# EAGLE schematic breakout (EAGLE 9.0.0)
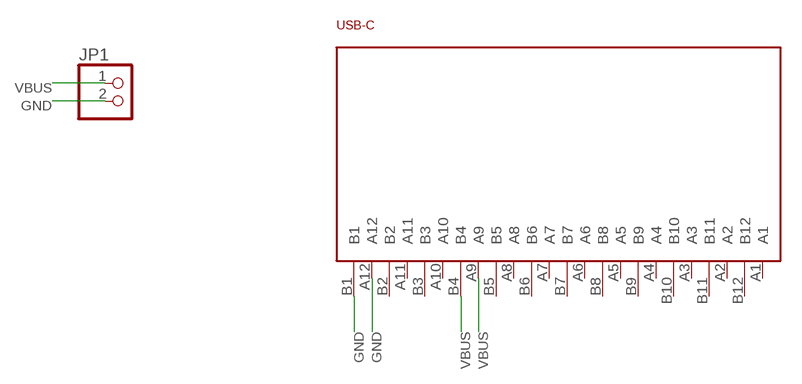
[diagram p0: schematic, sheet 1]

## Parts
JP1  PINHD-1X2  [1X02]
USB-C  USB-C  [USB-C]

## Nets
GND: JP1.2 USB-C.A12 USB-C.B1
VBUS: JP1.1 USB-C.A9 USB-C.B4
Unconnected: USB-C.A1 USB-C.A2 USB-C.A3 USB-C.A4 USB-C.A5 USB-C.A6 USB-C.A7 USB-C.A8 USB-C.A10 USB-C.A11 USB-C.B2 USB-C.B3 USB-C.B5 USB-C.B6 USB-C.B7 USB-C.B8 USB-C.B9 USB-C.B10 USB-C.B11 USB-C.B12

## Library data of the parts
JP1 = pinhead:PINHD-1X2: PIN HEADER
USB-C = psiboard:USB-C